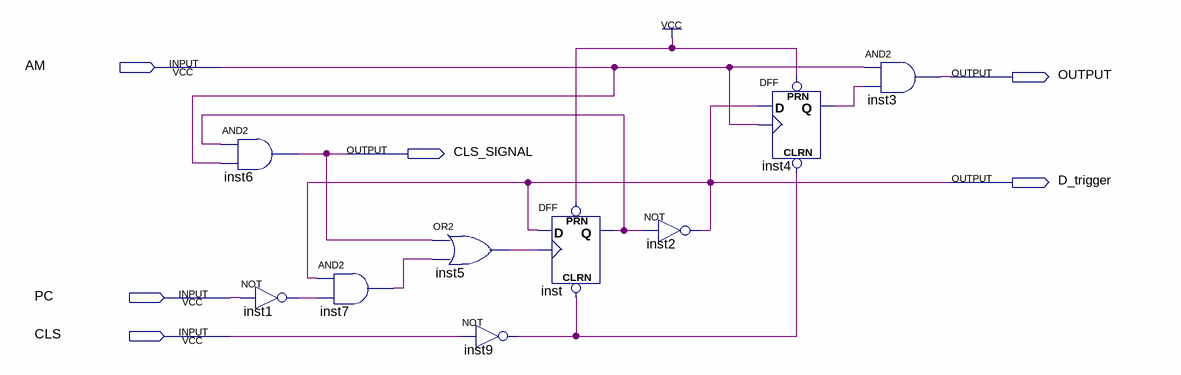
[diagram p0: schematic sheet]
// Quartus schematic Magic_Box.bdf as structural Verilog: 9 symbols, 6 pins
module Magic_Box (
  input  AM,
  input  PC,
  input  CLS,
  output OUTPUT,
  output CLS_SIGNAL,
  output D_trigger
);

  wire inst1_out, inst4_q, inst5_out, inst7_out, inst9_out, inst_q;

  and inst6 (CLS_SIGNAL, inst_q, AM);
  not inst1 (inst1_out, PC);
  and inst7 (inst7_out, D_trigger, inst1_out);
  or inst5 (inst5_out, CLS_SIGNAL, inst7_out);
  not inst9 (inst9_out, CLS);
  DFF inst (.CLRN(inst9_out), .CLK(inst5_out), .D(D_trigger), .PRN(1'b1), .Q(inst_q));
  not inst2 (D_trigger, inst_q);
  DFF inst4 (.CLRN(inst9_out), .CLK(AM), .D(D_trigger), .PRN(1'b1), .Q(inst4_q));
  and inst3 (OUTPUT, AM, inst4_q);
endmodule
